# EasyEDA Pro project 25工创PCB.eprj, board 显示板PCB
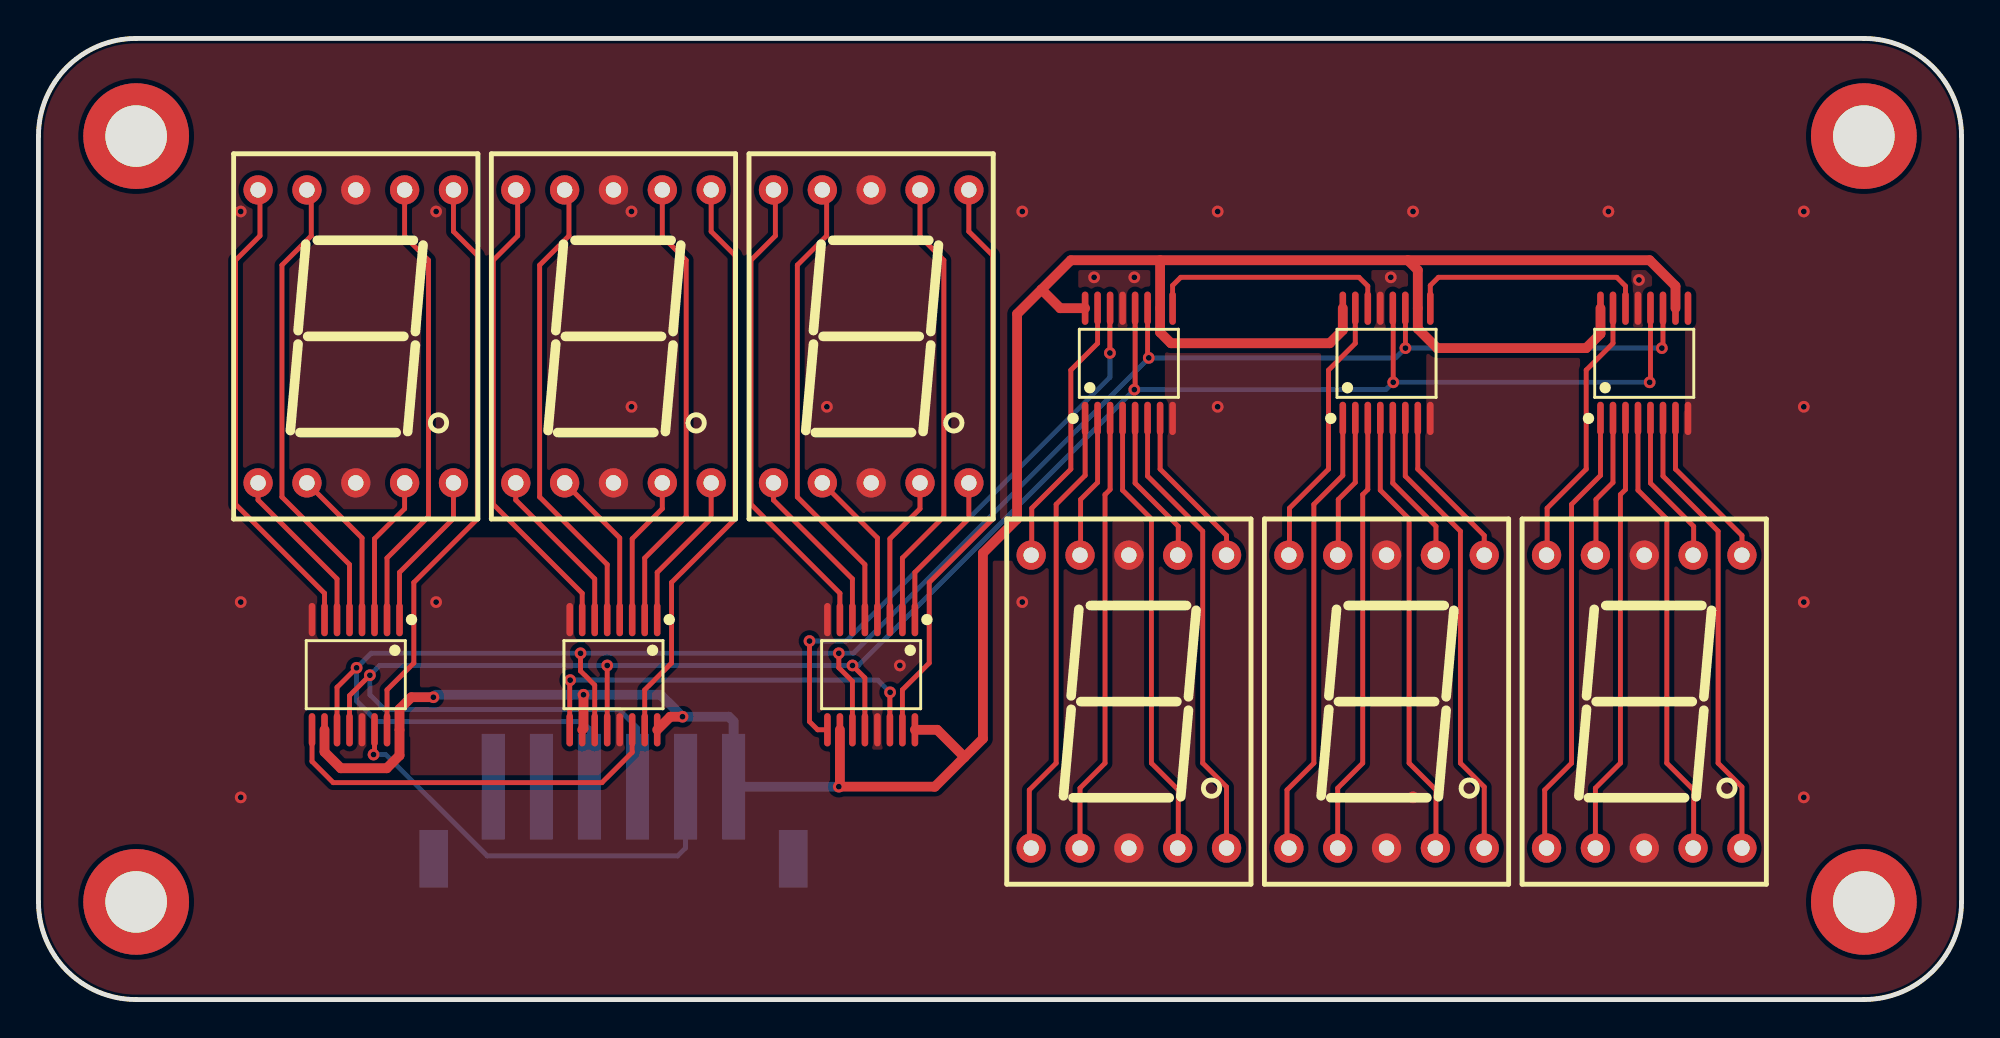
[diagram p14: board, top side]
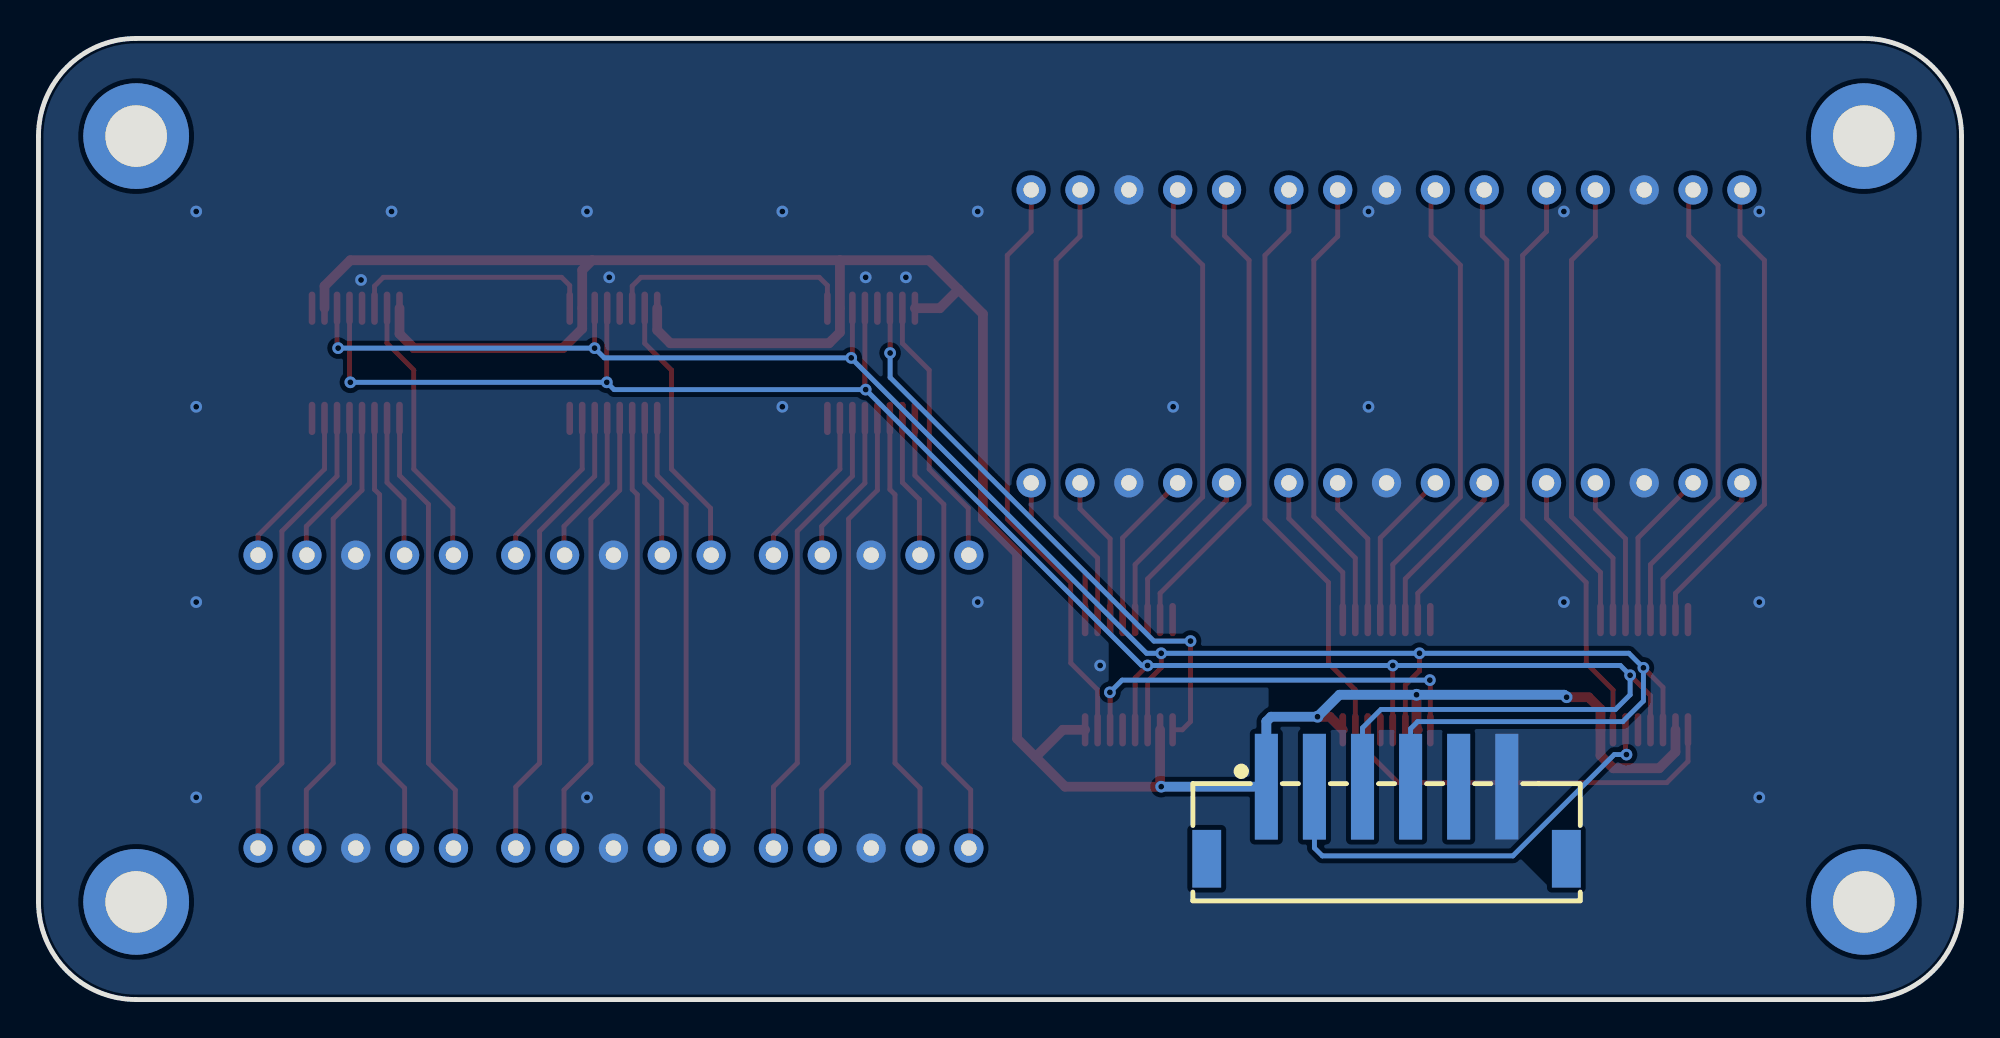
[diagram p15: board, bottom side, seen from below]

Outline 100 x 50 mm; copper layers: Top Layer, Bottom Layer. Coordinates in mm from the lower left corner of the outline.
Outline path: 0,44.92 0,5.08 arc(1.49,1.49) 5.08,0 94.92,0 arc(98.51,1.49) 100,5.08 100,44.92 arc(98.51,48.51) 94.92,50 5.08,50 arc(1.49,48.51) 0,44.92
Stack: Top Layer 0.035mm / Dielectric1 1.51mm FR4 er 4.5 / Bottom Layer 0.035mm

## Design rules (mm)
template: 自定义配置
spacing copperThickness1oz (default): track to track 0.102, other pairs 0.152 to 0.3
spacing copperThickness2oz: track to track 0.203, other pairs 0.152 to 0.3
track width copperThickness1oz (default): min 0.127, default 0.254, max 2.54
track width copperThickness2oz: min 0.203, default 0.254, max 2.54
differential pair differentialPair (default): width min 0.127, default 0.254, max 2.54; gap min 0.152, default 0.152
via viaSize (default): diameter min 0.5, default 0.61, max 10; hole min 0.3, default 0.305, max 6.3

## Placement (name value [footprint] x y rotation side)
LED1  SM410561N  [LED-SEG-TH_10P-L12.7-W19.0-P2.54-S15.24-BL]  16.5 34.5 0 top
LED2  SM410561N  [LED-SEG-TH_10P-L12.7-W19.0-P2.54-S15.24-BL]  29.9 34.5 0 top
LED3  SM410561N  [LED-SEG-TH_10P-L12.7-W19.0-P2.54-S15.24-BL]  43.3 34.5 0 top
LED4  SM410561N  [LED-SEG-TH_10P-L12.7-W19.0-P2.54-S15.24-BL]  56.7 15.5 0 top
LED5  SM410561N  [LED-SEG-TH_10P-L12.7-W19.0-P2.54-S15.24-BL]  70.1 15.5 0 top
LED6  SM410561N  [LED-SEG-TH_10P-L12.7-W19.0-P2.54-S15.24-BL]  83.5 15.5 0 top
NOREF  -  [Pad_e23]  94.92 5.08 0 top
NOREF#2  -  [Pad_e24]  5.08 5.08 0 top
NOREF#3  -  [Pad_e21]  94.92 44.92 0 top
NOREF#4  -  [Pad_e22]  5.08 44.92 0 top
U0  BX-XH2.54-6PLT  [CONN-SMD_6P-P2.50_HANBO_WAFER-254L-6A]  29.9 9.2 180 bottom
U1  74HC595PW,118  [TSSOP-16_L5.0-W4.4-P0.65-LS6.4-BL]  16.5 16.9 180 top
U2  74HC595PW,118  [TSSOP-16_L5.0-W4.4-P0.65-LS6.4-BL]  29.9 16.9 180 top
U3  74HC595PW,118  [TSSOP-16_L5.0-W4.4-P0.65-LS6.4-BL]  43.3 16.9 180 top
U4  74HC595PW,118  [TSSOP-16_L5.0-W4.4-P0.65-LS6.4-BL]  56.7 33.1 0 top
U5  74HC595PW,118  [TSSOP-16_L5.0-W4.4-P0.65-LS6.4-BL]  70.1 33.1 0 top
U6  74HC595PW,118  [TSSOP-16_L5.0-W4.4-P0.65-LS6.4-BL]  83.5 33.1 0 top

## Footprints (pads in the part's own frame, mm; a bottom-side part is the same pattern mirrored in y, then rotated)
CONN-SMD_6P-P2.50_HANBO_WAFER-254L-6A
  rect 1.2x5.5 smd: 1(-6.25,1.875) 2(-3.75,1.875) 3(-1.25,1.875) 4(1.25,1.875) 5(3.751,1.875) 6(6.25,1.875)
  rect 1.5x3 smd: 7(9.35,-1.875) 8(-9.35,-1.875)
LED-SEG-TH_10P-L12.7-W19.0-P2.54-S15.24-BL
  round 1.524 hole 0.8: 1(-5.08,-7.62) 2(-2.54,-7.62) 3(0,-7.62) 4(2.54,-7.62) 5(5.08,-7.62) 6(5.08,7.62) 7(2.54,7.62) 8(0,7.62) 9(-2.54,7.62) 10(-5.08,7.62)
Pad_e21
  round 5.5 hole 3.2: 101(0,0)
Pad_e22
  round 5.5 hole 3.2: 101(0,0)
Pad_e23
  round 5.5 hole 3.2: 101(0,0)
Pad_e24
  round 5.5 hole 3.2: 101(0,0)
TSSOP-16_L5.0-W4.4-P0.65-LS6.4-BL
  oval 0.343x1.732 smd: 1(-2.275,-2.866) 2(-1.625,-2.866) 3(-0.975,-2.866) 4(-0.325,-2.866) 5(0.325,-2.866) 6(0.975,-2.866) 7(1.625,-2.866) 8(2.275,-2.866) 9(2.275,2.866) 10(1.625,2.866) 11(0.975,2.866) 12(0.325,2.866) 13(-0.325,2.866) 14(-0.975,2.866) 15(-1.625,2.866) 16(-2.275,2.866)

## Nets
As in the schematic, except:
+5V: U0.1 U1.10 U1.16 U2.10 U2.16 U3.10 U3.16 U4.10 U4.16 U5.10 U5.16 U6.10 U6.16
PB12: U0.5

Pads without a net: NOREF 101; NOREF#2 101; NOREF#3 101; NOREF#4 101; U0 7 8; U6 9

## Via types
v1: diameter 0.61, hole 0.305, Top Layer to Bottom Layer, 45 vias

## Routing (per net, layer and track width the routed paths; a pad name or vN(x,y) marks a point on that pad's centre or on a via; arc(x,y) is an arc through that point)
+5V: length 146.2
  Top Layer w0.508: 52.16,36.94 53.13,35.97 U4.16 ; 52.16,36.94 50.89,35.67 50.89,25 49.11,23.22 49.11,13.57 48.15,12.61 ; 52.16,36.94 53.68,38.46 58.32,38.46 ; 48.15,12.61 46.73,14.03 U3.16 ; 48.15,12.61 46.62,11.08 v1(41.62,11.08) 41.68,11.13 U3.10 ; v1(33.49,14.71) 32.85,14.71 U2.16 ; 58.32,38.46 71.21,38.46 ; 58.32,38.46 U4.10 58.32,34.71 58.89,34.14 67.15,34.14 67.82,34.82 U5.16 ; 71.21,38.46 71.72,37.95 U5.10 71.72,34.9 72.73,33.89 80.48,33.89 81.22,34.64 U6.16 ; 71.21,38.46 83.78,38.46 85.12,37.12 U6.10 ; U2.10 28.34,14.1 v1(28.34,15.86) ; v1(20.54,15.73) 19.39,15.73 18.78,15.11 U1.16 18.78,12.7 18.11,12.03 15.72,12.03 14.88,12.88 U1.10
  Bottom Layer w0.508: v1(41.62,11.08) U0.1 36.15,14.47 35.9,14.71 v1(33.49,14.71) 32.35,15.86 v1(28.34,15.86) 20.66,15.86 v1(20.54,15.73)
GND:
  vias: v1(10.52,41) v1(10.52,20.68) v1(10.52,10.52) v1(20.68,41) v1(20.68,20.68) v1(30.84,41) v1(30.84,30.84) v1(41,30.84) v1(44.79,17.38) v1(51.16,41) v1(51.16,20.68) v1(54.89,37.57) v1(56.99,37.57) v1(61.32,41) v1(61.32,30.84) v1(70.32,37.57) v1(71.48,41) v1(71.48,10.52) v1(81.64,41) v1(83.23,37.44) v1(91.8,41) v1(91.8,30.84) v1(91.8,20.68) v1(91.8,10.52)
A1: length 23.8
  Top Layer w0.254: LED1.7 19.04,39.7 20.28,38.46 20.28,25.13 18.12,22.97 U1.2
A2: length 23.8
  Top Layer w0.254: LED2.7 32.44,39.7 33.68,38.46 33.68,25.13 31.53,22.97 U2.2
A3: length 23.8
  Top Layer w0.254: U3.2 44.93,22.97 47.08,25.13 47.08,38.46 45.84,39.7 LED3.7
A4: length 8.1
  Top Layer w0.254: U4.5 57.03,26.86 59.27,24.62 59.27,23.15 LED4.7
A5: length 8.1
  Top Layer w0.254: LED5.7 72.67,23.15 72.67,24.62 70.43,26.86 U5.5
A6: length 8.1
  Top Layer w0.254: LED6.7 86.07,23.15 86.07,24.62 83.82,26.86 U6.5
B1: length 30.5
  Top Layer w0.254: LED1.6 21.58,39.96 22.82,38.72 22.82,25 19.52,21.7 19.52,17.51 18.12,16.11 U1.15
B2: length 30.5
  Top Layer w0.254: U2.15 31.53,16.11 32.92,17.51 32.92,21.7 36.22,25 36.22,38.72 34.98,39.96 LED2.6
B3: length 30.5
  Top Layer w0.254: LED3.6 48.38,39.96 49.62,38.72 49.62,25 46.32,21.7 46.32,17.51 44.93,16.11 U3.15
B4: length 8.5
  Top Layer w0.254: LED4.6 61.78,24.14 58.32,27.6 U4.7
B5: length 8.5
  Top Layer w0.254: LED5.6 75.18,24.14 71.72,27.6 U5.7
B6: length 8.5
  Top Layer w0.254: LED6.6 88.58,24.14 85.12,27.6 U6.7
C1: length 7.8
  Top Layer w0.254: U1.3 17.47,23.97 19.04,25.54 LED1.4
C2: length 7.8
  Top Layer w0.254: U2.3 30.88,23.97 32.44,25.54 LED2.4
C3: length 7.8
  Top Layer w0.254: U3.3 44.28,23.97 45.84,25.54 LED3.4
C4: length 23.6
  Top Layer w0.254: LED4.4 59.27,7.91 59.27,10.9 57.87,12.3 57.87,25 56.38,26.5 U4.4
C5: length 23.6
  Top Layer w0.254: LED5.4 72.67,7.91 72.67,10.9 71.27,12.3 71.27,25 69.78,26.5 U5.4
C6: length 23.6
  Top Layer w0.254: LED6.4 86.07,7.91 86.07,10.9 84.67,12.3 84.67,25 83.18,26.5 U6.4
D1: length 8.3
  Top Layer w0.254: LED1.2 16.83,24.02 U1.4
D2: length 8.3
  Top Layer w0.254: LED2.2 30.22,24.02 U2.4
D3: length 8.3
  Top Layer w0.254: U3.4 43.62,24.02 LED3.2
D4: length 23
  Top Layer w0.254: LED4.2 54.16,11 55.46,12.3 55.46,26.27 55.72,26.53 U4.3
D5: length 23
  Top Layer w0.254: LED5.2 67.56,11 68.86,12.3 68.86,26.27 69.12,26.53 U5.3
D6: length 23
  Top Layer w0.254: LED6.2 80.96,11 82.26,12.3 82.26,26.27 82.53,26.53 U6.3
DP1: length 8.3
  Top Layer w0.254: U1.1 18.78,22.22 21.58,25.03 LED1.5
DP2: length 8.3
  Top Layer w0.254: U2.1 32.18,22.22 34.98,25.03 LED2.5
DP3: length 8.3
  Top Layer w0.254: LED3.5 48.38,25.03 45.57,22.22 U3.1
DP4: length 24.1
  Top Layer w0.254: LED4.5 61.78,11.06 60.54,12.3 60.54,24.36 57.68,27.23 57.68,30.23
DP5: length 24.1
  Top Layer w0.254: LED5.5 75.18,11.06 73.94,12.3 73.94,24.36 71.07,27.23 U5.6
DP6: length 24.1
  Top Layer w0.254: LED6.5 88.58,11.06 87.34,12.3 87.34,24.36 84.47,27.23 U6.6
E1: length 8.8
  Top Layer w0.254: U1.6 15.53,21.88 11.42,25.99 LED1.1
E2: length 8.8
  Top Layer w0.254: U2.6 28.93,21.88 24.82,25.99 LED2.1
E3: length 8.8
  Top Layer w0.254: 42.32,19.77 42.32,21.88 38.22,25.99 LED3.1
E4: length 23.6
  Top Layer w0.254: LED4.1 51.52,7.98 51.52,10.9 52.92,12.3 52.92,25.76 54.43,27.27 U4.1
E5: length 23.6
  Top Layer w0.254: LED5.1 64.92,7.98 64.92,10.9 66.32,12.3 66.32,25.76 67.82,27.27 U5.1
E6: length 23.6
  Top Layer w0.254: LED6.1 78.32,7.98 78.32,10.9 79.72,12.3 79.72,25.76 81.22,27.27 U6.1
F1: length 24.5
  Top Layer w0.254: LED1.9 14.19,41.89 14.19,39.73 12.66,38.21 12.66,26.14 16.17,22.63 U1.5
F2: length 24.5
  Top Layer w0.254: 29.57,19.77 29.57,22.63 26.06,26.14 26.06,38.21 27.59,39.73 27.59,41.89 LED2.9
F3: length 24.5
  Top Layer w0.254: LED3.9 40.99,41.89 40.99,39.73 39.46,38.21 39.46,26.14 42.97,22.63 U3.5
F4: length 7.5
  Top Layer w0.254: U4.2 55.07,26.9 54.19,26.02 54.19,23.15 LED4.9
F5: length 7.5
  Top Layer w0.254: LED5.9 67.59,23.15 67.59,26.02 68.47,26.9 U5.2
F6: length 7.5
  Top Layer w0.254: U6.2 81.88,26.9 80.99,26.02 80.99,23.15 LED6.9
G1: length 24.8
  Top Layer w0.254: U1.7 14.88,21.14 10.25,25.76 10.25,38.46 11.52,39.73 11.52,42.02 LED1.10
G2: length 24.8
  Top Layer w0.254: LED2.10 24.92,42.02 24.92,39.73 23.65,38.46 23.65,25.76 28.28,21.14 U2.7
G3: length 24.8
  Top Layer w0.254: LED3.10 38.32,42.02 38.32,39.73 37.05,38.46 37.05,25.76 41.68,21.14 U3.7
G4: length 14.3
  Top Layer w0.254: U4.15 55.07,34.14 53.68,32.75 53.68,27.59 51.65,25.56 51.65,23.15 LED4.10
G5: length 14.3
  Top Layer w0.254: LED5.10 65.05,23.15 65.05,25.56 67.08,27.59 67.08,32.75 68.47,34.14 U5.15
G6: length 14.3
  Top Layer w0.254: U6.15 81.88,34.14 80.48,32.75 80.48,27.59 78.45,25.56 78.45,23.15 LED6.10
PB13: length 111.2
  Top Layer w0.254: v1(41.62,18.02) 41.62,17.27 42.32,16.56 42.32,14.03 ; v1(57.74,33.38) 57.68,33.44 57.68,35.97 ; U5.11 71.08,35.96 v1(71.08,33.89) ; v1(16.54,17.26) 15.53,16.24 U1.11 ; U6.11 84.47,33.95 v1(84.42,33.89) ; U2.11 28.93,16.36 28.19,17.09 v1(28.19,18.02)
  Bottom Layer w0.254: U0.4 28.65,14.09 28.28,14.46 17.61,14.46 16.54,15.53 v1(16.54,17.26) 17.3,18.02 v1(28.19,18.02) v1(41.62,18.02) 42.38,18.02 57.74,33.37 v1(57.74,33.38) 70.57,33.38 v1(71.08,33.89) v1(84.42,33.89)
PB14: length 113.8
  Top Layer w0.254: U4.12 57.03,31.77 v1(56.99,31.73) ; U6.12 83.82,32.16 v1(83.78,32.11) ; 29.57,14.03 v1(29.57,17.38) ; U1.12 16.17,15.81 v1(17.23,16.87) ; v1(42.33,17.38) 42.97,16.73 U3.12 ; v1(70.45,32.11) 70.45,35.94 U5.12
  Bottom Layer w0.254: U0.3 31.15,14.13 30.19,15.09 18,15.09 17.23,15.86 v1(17.23,16.87) 17.74,17.38 v1(29.57,17.38) v1(42.33,17.38) 42.63,17.38 v1(56.99,31.73) 70.07,31.73 v1(70.45,32.11) v1(83.78,32.11)
PB15: length 23.1
  Top Layer w0.254: v1(17.42,12.74) 17.47,12.8 U1.14
  Bottom Layer w0.254: U0.2 33.65,7.89 33.24,7.47 23.33,7.47 18.06,12.74 v1(17.42,12.74)
$1N1052: length 21.4
  Top Layer w0.254: v1(44.28,15.98) 44.28,15.97 U3.14 ; U2.9 27.62,16.59 v1(27.65,16.62)
  Bottom Layer w0.254: v1(27.65,16.62) 43.65,16.62 v1(44.28,15.98)
$1N1079: length 30.2
  Top Layer w0.254: U4.14 55.72,35.96 v1(55.72,33.64) ; v1(40.09,18.65) 40.09,14.46 40.52,14.03 U3.9
  Bottom Layer w0.254: v1(55.72,33.64) 55.72,32.37 42,18.65 v1(40.09,18.65)
$1N1106: length 12.8
  Top Layer w0.254: U5.14 69.12,37.12 68.67,37.57 59.4,37.57 58.97,37.15 U4.9
$1N1133: length 12.8
  Top Layer w0.254: U6.14 82.53,37.12 82.07,37.57 72.8,37.57 72.38,37.15 U5.9
$1N1798: length 20.6
  Top Layer w0.254: U2.14 30.88,12.86 29.3,11.28 15.33,11.28 14.22,12.39 U1.9

## Copper pours and planes (outline as drawn; the poured copper is in the pictures)
GND on Top Layer: -2.7,52.56 103.21,52.56 103.21,-3.07 -2.7,-3.07
GND on Bottom Layer: -8.17,58.02 109.69,58.02 109.69,-8.4 -8.17,-8.4
